# EAGLE design BD0004_1 (Tester) (EAGLE 9.6.2)
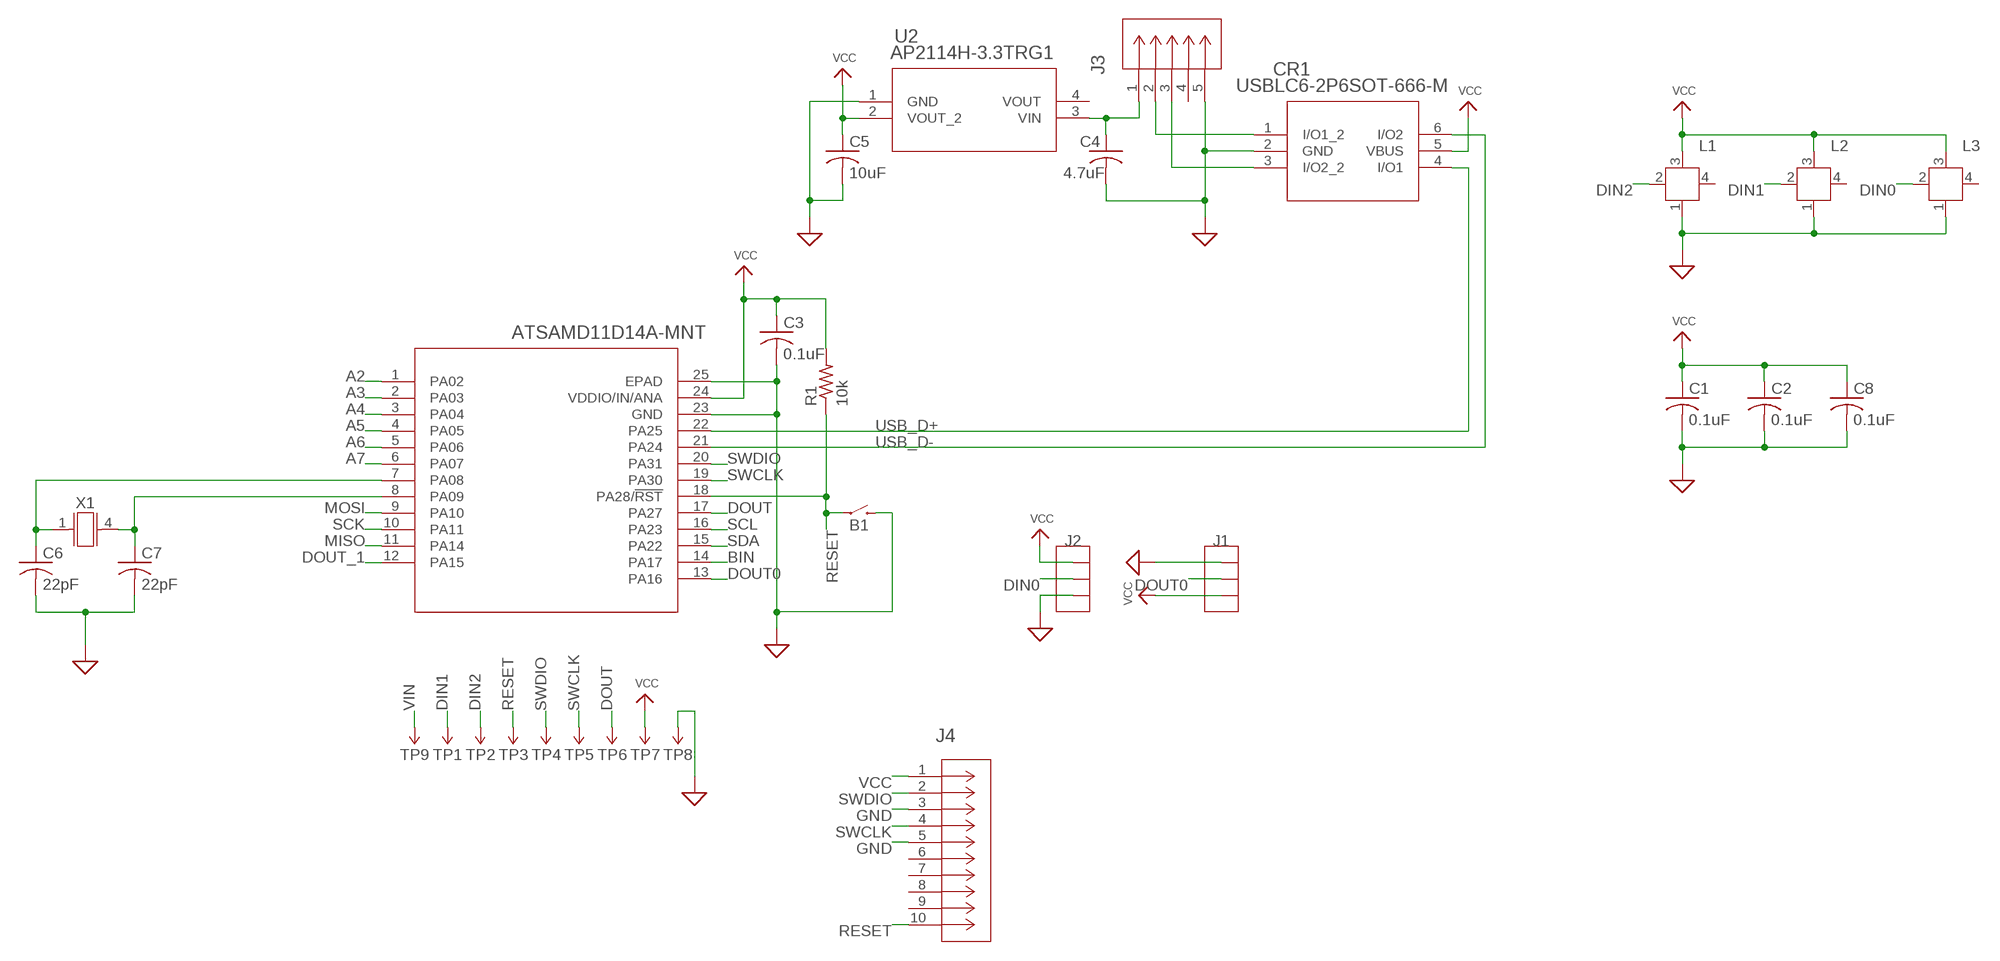
[diagram p0: schematic, sheet 1]

## Parts
B1  EVQ-P7A01P  [4-SMD_BUTTON]
C1  0.1uF  C-USC0402  [C0402]
C2  0.1uF  C-USC0402  [C0402]
C3  0.1uF  C-USC0402  [C0402]
C4  4.7uF  C-USC0805  [C0805]
C5  10uF  C-USC0805  [C0805]
C6  22pF  C-USC0402  [C0402]
C7  22pF  C-USC0402  [C0402]
C8  0.1uF  C-USC0402  [C0402]
CR1  USBLC6-2P6SOT-666-M  [SOT-666-M]
J1  HEADER_1X3MALE  [M3SMD]
J2  HEADER_1X3FEMALE  [F3SMD]
J3  1050171001  [CON00679_5]
J4  20021121-00010C4LF  [CONN_00010C4LF]
L1  WS2812B  [SK6812]
L2  WS2812B  [SK6812]
L3  WS2812B  [SK6812]
R1  10k  R-US_R0402  [R0402]
TP1  POGO  [R-1-CR]
TP2  POGO  [R-1-CR]
TP3  POGO  [R-1-CR]
TP4  POGO  [R-1-CR]
TP5  POGO  [R-1-CR]
TP6  POGO  [R-1-CR]
TP7  POGO  [R-1-CR]
TP8  POGO  [R-1-CR]
TP9  POGO  [R-1-CR]
U1  ATSAMD11D14A-MNT  [QFN24_4X4MC]
U2  AP2114H-3.3TRG1  [SOT-223]
X1  MC-146-32.7680JKA-A0:ROHS  [4-SMD_FLAT_LEADS]

## Nets
A2: U1.1(PA02)
A3: U1.2(PA03)
A4: U1.3(PA04)
A5: U1.4(PA05)
A6: U1.5(PA06)
A7: U1.6(PA07)
BIN: U1.14(PA17)
DIN0: J2.2A J2.2B L3.2(DIN)
DIN1: L2.2(DIN) TP1.P$1
DIN2: L1.2(DIN) TP2.P$1
DOUT: TP6.P$1 U1.17(PA27)
DOUT0: J1.2 U1.13(PA16)
DOUT_1: U1.12(PA15)
GND: B1.2A B1.2B C1.2 C2.2 C3.2 C4.2 C5.2 C6.2 C7.2 C8.2 CR1.2(GND) J1.1 J2.3A J2.3B J3.5 J4.3 J4.5 L1.1(VSS) L2.1(VSS) L3.1(VSS) TP8.P$1 U1.23(GND) U1.25(EPAD) U2.1(GND) ; supply symbol labelled SUP
MISO: U1.11(PA14)
MOSI: U1.9(PA10)
N$1: CR1.3(I/O2_2) J3.3
N$3: CR1.1(I/O1_2) J3.2
N$4: C6.1 U1.7(PA08) X1.1
N$5: C7.1 U1.8(PA09) X1.4
RESET: B1.1A B1.1B J4.10 R1.1 TP3.P$1 U1.18(PA28/!RST)
SCK: U1.10(PA11)
SCL: U1.16(PA23)
SDA: U1.15(PA22)
SWCLK: J4.4 TP5.P$1 U1.19(PA30)
SWDIO: J4.2 TP4.P$1 U1.20(PA31)
USB_D+: CR1.4(I/O1) U1.22(PA25)
USB_D-: CR1.6(I/O2) U1.21(PA24)
VCC: C1.1 C2.1 C3.1 C5.1 C8.1 CR1.5(VBUS) J1.3 J2.1A J2.1B J4.1 L1.3(VDD) L2.3(VDD) L3.3(VDD) R1.2 TP7.P$1 U1.24(VDDIO/IN/ANA) U2.2(VOUT_2)
VIN: C4.1 J3.1 TP9.P$1 U2.3(VIN)
Unconnected: J3.4 J4.6 J4.7 J4.8 J4.9 L1.4(DOUT) L2.4(DOUT) L3.4(DOUT) U2.4(VOUT)

## Library data of the parts
B1 = Clock:EVQ-P7A01P
C1-C8 = adafruit:C-US: CAPACITOR, American symbol
CR1 = Clock:USBLC6-2P6; BUILT_BY: EMA_UL_Team; MANUFACTURER_PART_NUMBER: USBLC6-2P6; VENDOR: STMicroelectronics
J1 J2 = Clock:HEADER_1X3
J3 = Clock:1050171001; BUILT_BY: EMA_Don; COPYRIGHT: Copyright (C) 2016 Accelerated Designs. All rights reserved; MANUFACTURER_PART_NUMBER: 1050171001; VENDOR: Molex Connector Corporation
J4 = Clock:20021121-00010C4LF; BUILT_BY: EMA_Matt; COPYRIGHT: Copyright (C) 2018 Accelerated Designs. All rights reserved; MANUFACTURER_PART_NUMBER: 20021121-00010C4LF; VENDOR: Amphenol
L1-L3 = Clock:WS2812B
R1 = adafruit:R-US_: RESISTOR, American symbol
TP1-TP9 = Clock:POGO
U1 = Clock:ATSAMD11D14A-MNT; BUILT_BY: EMA_Molly; COPYRIGHT: Copyright (C) 2018 Accelerated Designs. All rights reserved; MANUFACTURER_PART_NUMBER: ATSAMD11D14A-MNT; VENDOR: Microchip
U2 = Clock:AP2114H-3.3TRG1; BUILT_BY: EMA_UL_Team; MANUFACTURER_PART_NUMBER: AP2114H-3.3TRG1; VENDOR: Diodes Inc
X1 = Clock:MC-146-32.7680JKA-A0:ROHS

## Board
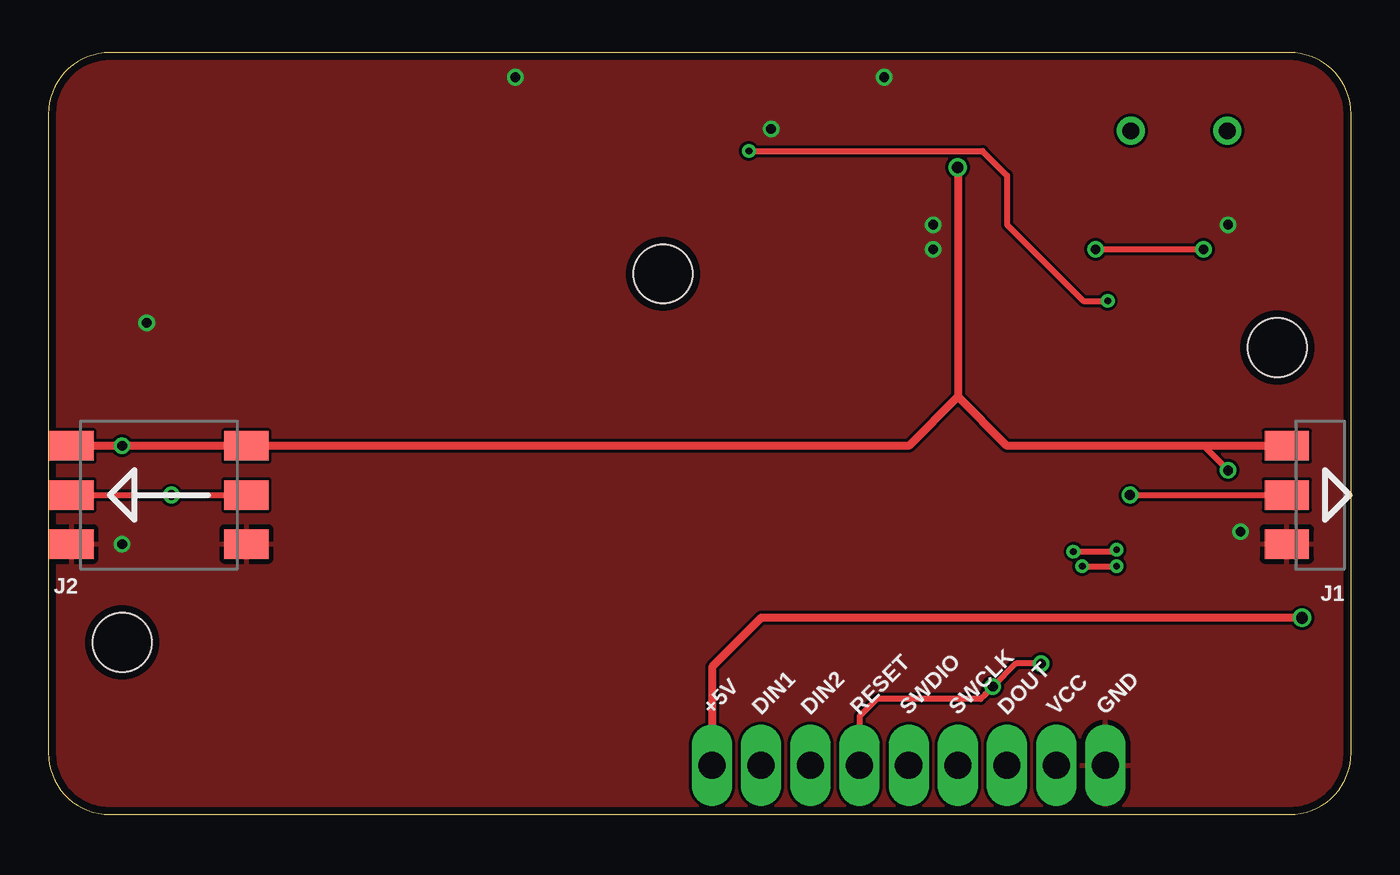
[diagram p1: board, top side]
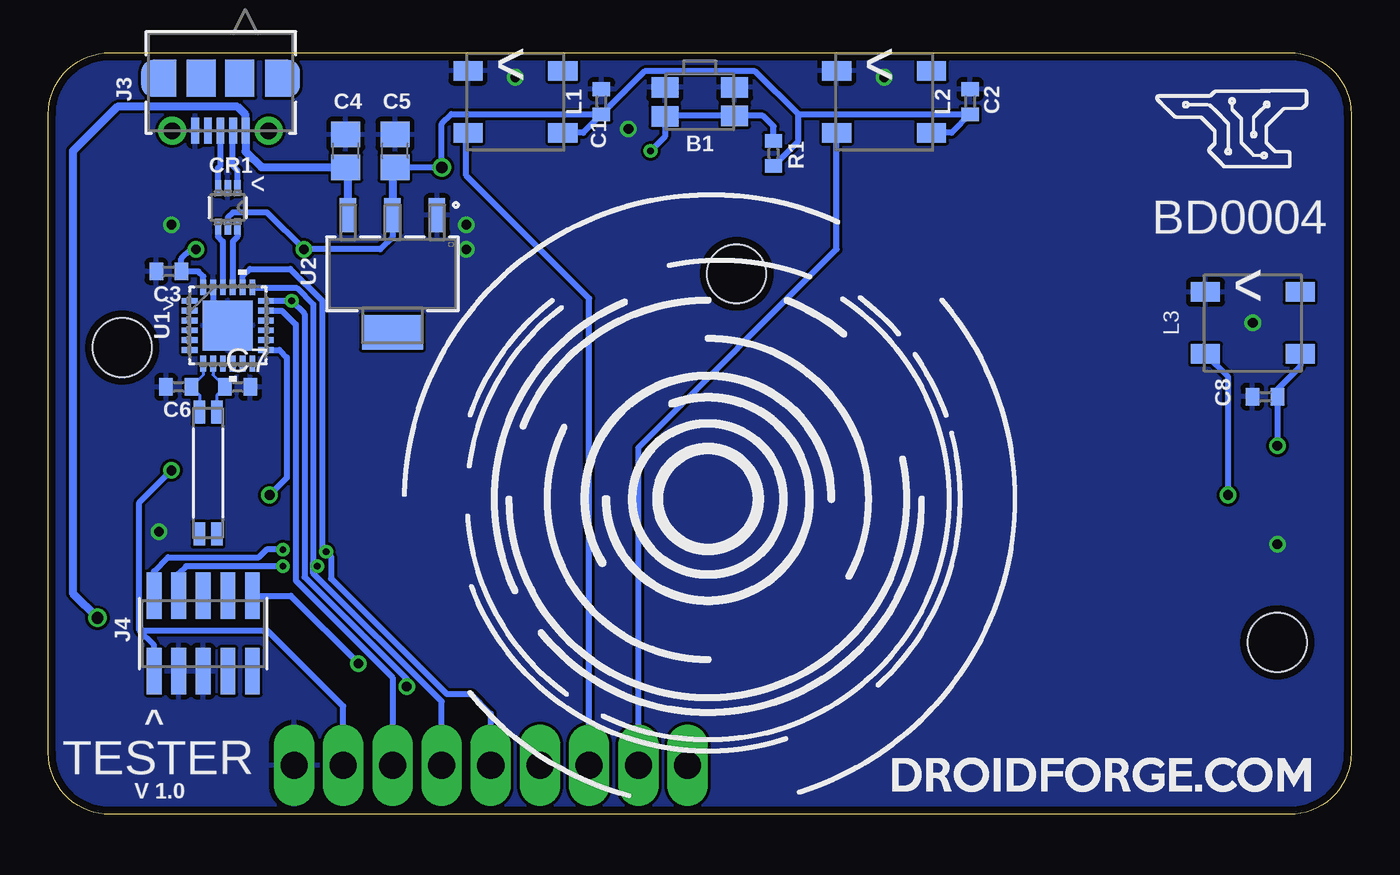
[diagram p2: board, bottom side, seen from below]

Size 67.31 x 39.37 mm. Coordinates in mm from the lower left corner, seen from the top.
Outline: 0,36.2 0,3.17 arc90 3.17,0 64.14,0 arc90 67.31,3.17 67.31,36.2 arc90 64.14,39.37 3.17,39.37 arc90 0,36.2
Copper layers (1*16): Top 0.035mm / dielectric 1.5mm / Bottom 0.035mm
Design rules "default *": minimum track width 6mil, minimum drill 0.35mm, track to track 6mil, track to pad 6mil, pad to pad 6mil, via to via 6mil, smd to smd 6mil, copper to edge 15mil, drill to drill 6mil, minimum pad ring 10mil, minimum via ring 7mil, stop-mask expansion 3mil, vias tented up to drill 25mil, thermal gap 10mil
Holes 3.05 mm at 31.75,27.94 3.81,8.89 63.5,24.13

### Footprints (pad centres in the part's own frame; a part is rotated, then mirrored left to right if it is on the bottom)
4-SMD_BUTTON = smd 1.4 x 1.05: 1A -1.8,0.725; 1B 1.8,0.75; 2A -1.8,-0.75; 2B 1.8,-0.75
C0402 = smd 0.7 x 0.9: 1 -0.65,0; 2 0.65,0
C0805 = smd 1.3 x 1.5: 1 -0.85,0; 2 0.85,0
SOT-666-M = smd 0.762 x 0.33: 1 -1.029,0.5; 2 -1.029,0; 3 -1.029,-0.5; 4 1.029,-0.5; 5 1.029,0; 6 1.029,0.5
M3SMD = smd 1.524 x 2.286: 1 -2.54,4.521; 2 0,4.521; 3 2.54,4.521
F3SMD = smd 1.524 x 2.286: 1A -2.54,4.521; 1B -2.54,-4.521; 2A 0,4.521; 2B 0,-4.521; 3A 2.54,4.521; 3B 2.54,-4.521
CON00679_5 = smd 0.406 x 1.346: 1 -1.302,2.504; 2 -0.652,2.504; 3 -0.002,2.504; 4 0.648,2.504; 5 1.298,2.504 | drill 0.864 pad 1.448: 6 -2.489,2.515; 7 2.489,2.515 | smd 1.499 x 1.905: 8 -1.002,-0.196; 9 0.998,-0.196 | smd 1.194 x 1.905: 10 -3.502,-0.196; 11 3.498,-0.196 | smd 1.201 x 1.905: 12 -2.902,-0.196; 13 2.898,-0.196
CONN_00010C4LF = smd 0.762 x 2.388: 1 -5.08,-3.9; 2 -5.08,0; 3 -3.81,-3.9; 4 -3.81,0; 5 -2.54,-3.9; 6 -2.54,0; 7 -1.27,-3.9; 8 -1.27,0; 9 0,-3.9; 10 0,0
SK6812 = smd 1.5 x 1: 1 -2.45,1.6; 2 -2.45,-1.6; 3 2.45,-1.6; 4 2.45,1.6
R0402 = smd 0.7 x 0.9: 1 -0.65,0; 2 0.65,0
R-1-CR = drill 1.397 pad 1.676 long: P$1 0,0
QFN24_4X4MC = smd 0.813 x 0.305: 1 -1.968,1.27; 2 -1.968,0.762; 3 -1.968,0.254; 4 -1.968,-0.254; 5 -1.968,-0.762; 6 -1.968,-1.27; 13 1.968,-1.27; 14 1.968,-0.762; 15 1.968,-0.254; 16 1.968,0.254; 17 1.968,0.762; 18 1.968,1.27 | smd 0.305 x 0.813: 7 -1.27,-1.968; 8 -0.762,-1.968; 9 -0.254,-1.968; 10 0.254,-1.968; 11 0.762,-1.968; 12 1.27,-1.968; 19 1.27,1.968; 20 0.762,1.968; 21 0.254,1.968; 22 -0.254,1.968; 23 -0.762,1.968; 24 -1.27,1.968 | smd 2.591 x 2.591: 25 0,0
SOT-223 = smd 0.851 x 1.761: 1 -2.3,-3.025; 2 0,-3.025; 3 2.3,-3.025 | smd 3.151 x 1.761: 4 0,3.025
4-SMD_FLAT_LEADS = smd 1.2 x 0.6: 1 -3.15,-0.45; 2 3.15,-0.45; 3 3.15,0.45; 4 -3.15,0.45

### Placement (x,y rotation side)
B1  33.66,36.83 180 bottom
C1  38.73,36.83 90 bottom
C2  19.68,36.83 90 bottom
C3  61.09,28.07 180 bottom
C4  51.94,34.29 90 bottom
C5  49.4,34.29 90 bottom
C6  60.58,22.1 180 bottom
C7  57.53,22.1 0 bottom
C8  4.45,21.59 180 bottom
CR1  58.04,31.37 270 bottom
J1  68.5,16.51 90 top
J2  5.71,16.51 270 top
J3  58.42,37.85 180 bottom
J4  56.77,11.3 0 bottom
L1  43.18,36.83 0 bottom
L2  24.13,36.83 0 bottom
L3  5.08,25.4 0 bottom
R1  29.84,34.16 270 bottom
TP1  36.83,2.54 0 top
TP2  39.37,2.54 0 top
TP3  41.91,2.54 0 top
TP4  44.45,2.54 0 top
TP5  46.99,2.54 0 top
TP6  49.53,2.54 0 top
TP7  52.07,2.54 0 top
TP8  54.61,2.54 0 top
TP9  34.29,2.54 0 top
U1  58.04,25.27 0 bottom
U2  49.53,27.94 180 bottom
X1  59.05,17.65 270 bottom

### Tracks (layer width: path | path; a pad name or v marks a point on that pad's centre or on a via)
DIN0  (via drill 0.5)
  Top 0.305: J2.2B v6.35,16.51 J2.2A
  Bottom 0.305: v6.35,16.51 6.35,22.62 L3.2
DIN1
  Bottom 0.305: L2.2 26.58,29.21 36.83,18.96 TP1.P$1
DIN2
  Bottom 0.305: TP2.P$1 39.37,26.67 45.72,33.02 45.72,35.56 45.63,35.47 L1.2
DOUT
  Bottom 0.305: U1.17 55.24,26.04 54.53,25.32 54.53,12.09 49.53,7.08 TP6.P$1
DOUT0  (via drill 0.5)
  Top 0.305: v55.88,16.51 J1.2
  Bottom 0.305: U1.13 55.37,24 54.99,23.62 54.99,17.4 v55.88,16.51
GND  (via drill 0.5)
  Bottom 0.305: U1.23 58.8,25.78 58.29,25.27 U1.25
  other vias: 3.81,13.97 60.96,30.48 45.72,30.48 45.72,29.21 24.13,38.1 43.18,38.1 5.08,25.4 61.59,14.61 37.34,35.43
  pour Top: -2.54,-2.54 69.85,-2.54 69.85,43.18 -2.54,43.18
  pour Bottom: -2.54,-2.54 69.85,-2.54 69.85,43.18 -2.54,43.18
N$1
  Bottom 0.305: CR1.3 58.54,33.41 58.42,33.53 J3.3
N$3
  Bottom 0.152: 57.78,35.33 J3.2
  Bottom 0.305: CR1.1 57.54,33.28 57.78,33.53 57.78,35.33
N$4
  Bottom 0.152: U1.7 59.31,22.72 C6.1 59.51,21.67 X1.1
N$5
  Bottom 0.152: U1.8 58.8,22.72 C7.1 58.6,21.67 X1.4
RESET  (via drill 0.35, 0.5)
  Top 0.305: v36.2,34.29 48.26,34.29 49.53,33.02 49.53,30.48 53.47,26.54 v54.74,26.54 | TP3.P$1 41.91,5.08 42.8,5.97 48.16,5.97 48.4,6.21 v48.8,6.6 49.99,7.8 v51.29,7.8
  Bottom 0.305: R1.1 29.84,35.56 30.39,36.1 B1.1A 35.43,36.1 B1.1B 35.45,35.03 v36.2,34.29 | U1.18 v54.74,26.54 54.08,25.88 54.08,12.27 48.8,7 v48.8,6.6 | J4.10 54.79,11.3 v51.29,7.8
SWCLK  (via drill 0.35)
  Top 0.305: v53.42,12.83 v55.19,12.83
  Bottom 0.305: TP5.P$1 46.99,5.83 53.62,12.46 53.62,13.03 | U1.19 56.73,27.2 54.47,27.2 53.62,26.36 53.62,16.51 53.62,13.03 | 53.62,13.03 v53.42,12.83 | J4.4 60.58,12.45 60.2,12.83 v55.19,12.83
SWDIO  (via drill 0.35)
  Top 0.305: v52.96,13.58 55.09,13.58 v55.19,13.69
  Bottom 0.305: U1.20 57.28,27.81 56.9,28.19 54.81,28.19 53.16,26.55 53.16,13.78 v52.96,13.58 52.7,13.33 52.7,12.2 46.73,6.22 45.47,6.22 44.45,5.21 TP4.P$1 | v55.19,13.69 56.04,13.69 56.44,13.28 61.14,13.28 61.85,12.57 J4.2
USB_D+
  Bottom 0.305: U1.22 58.29,29.62 58.54,29.86 CR1.4
USB_D-
  Bottom 0.305: U1.21 57.78,29.62 57.54,29.86 CR1.6
VCC  (via drill 0.5, 0.6)
  Top 0.305: v54.1,29.21 v59.69,29.21 | v60.96,17.78 59.69,19.05 58.42,19.05
  Top 0.406: v46.99,33.44 46.99,21.59 | 46.99,21.59 44.45,19.05 J2.1A v3.81,19.05 J2.1B | J1.3 58.42,19.05 49.53,19.05 46.99,21.59
  Bottom 0.305: C5.1 v46.99,33.44 46.99,35.69 46.48,36.2 38.75,36.2 C1.1 | L2.3 20.64,35.23 C2.1 28.56,36.18 | C1.1 39.69,35.23 L1.3 | U1.24 59.31,27.81 59.56,28.07 C3.1 60.44,28.72 59.94,29.21 v59.69,29.21 | R1.2 28.56,34.8 28.56,36.18 | L3.3 2.63,23.15 3.79,21.99 C8.1 3.81,21.57 v3.81,19.05 | CR1.5 58.04,30.86 57.78,31.11 56.01,31.11 v54.1,29.21 50.16,29.21 49.53,29.84 U2.2 | 28.56,36.18 30.79,38.41 36.51,38.41 C1.1 | J4.1 61.85,8.76 62.61,9.53 | v60.96,17.78 62.61,16.13 62.61,9.53 | TP7.P$1 52.07,5.59 56.01,9.53 62.61,9.53
  Bottom 0.406: C5.1 49.53,33.31 U2.2
VIN  (via drill 0.6)
  Top 0.406: v64.77,10.16 36.83,10.16 34.29,7.62 TP9.P$1
  Bottom 0.406: U2.3 51.83,33.33 C4.1 56.3,33.44 57.12,34.26 J3.1 57.12,36.16 57.53,36.58 63.75,36.58 66.04,34.29 66.04,11.43 v64.77,10.16

### Text on the board
tPlace: +5V | DIN1 | DIN2 | RESET | SWDIO | SWCLK | DOUT | VCC | GND
bPlace: BD0004 | TESTER | V 1.0